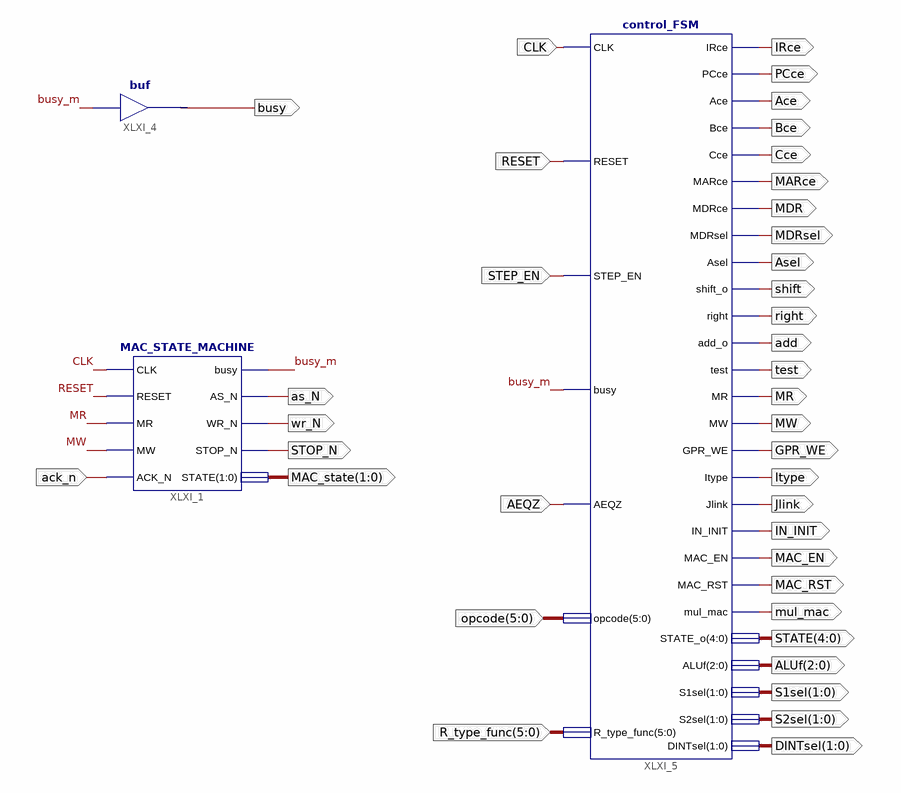
[diagram p0: schematic sheet 1]
// Xilinx ISE schematic control.sch (spartan6) as structural Verilog: 3 symbols, 40 ports
module control (
  input  CLK,
  input  RESET,
  input  ack_n,
  input  STEP_EN,
  input  AEQZ,
  input  [5:0] opcode,
  input  [5:0] R_type_func,
  output MR,
  output MW,
  output as_N,
  output wr_N,
  output STOP_N,
  output [1:0] MAC_state,
  output busy_m,
  output busy,
  output IRce,
  output PCce,
  output Ace,
  output Bce,
  output Cce,
  output MARce,
  output MDR,
  output MDRsel,
  output Asel,
  output shift,
  output right,
  output add,
  output test,
  output GPR_WE,
  output Itype,
  output Jlink,
  output IN_INIT,
  output [4:0] STATE,
  output [2:0] ALUf,
  output [1:0] S1sel,
  output [1:0] S2sel,
  output [1:0] DINTsel,
  output MAC_EN,
  output MAC_RST,
  output mul_mac
);

  MAC_STATE_MACHINE XLXI_1 (
    .CLK(CLK), .RESET(RESET), .MR(MR), .MW(MW), .ACK_N(ack_n), .busy(busy_m), .AS_N(as_N), .WR_N(wr_N),
    .STOP_N(STOP_N), .STATE(MAC_state));
  buf XLXI_4 (busy, busy_m);
  control_FSM XLXI_5 (
    .CLK(CLK), .RESET(RESET), .STEP_EN(STEP_EN), .busy(busy_m), .AEQZ(AEQZ), .opcode(opcode),
    .R_type_func(R_type_func), .IRce(IRce), .PCce(PCce), .Ace(Ace), .Bce(Bce), .Cce(Cce), .MARce(MARce),
    .MDRce(MDR), .MDRsel(MDRsel), .Asel(Asel), .shift_o(shift), .right(right), .add_o(add), .test(test),
    .MR(MR), .MW(MW), .GPR_WE(GPR_WE), .Itype(Itype), .Jlink(Jlink), .IN_INIT(IN_INIT), .MAC_EN(MAC_EN),
    .MAC_RST(MAC_RST), .mul_mac(mul_mac), .STATE_o(STATE), .ALUf(ALUf), .S1sel(S1sel), .S2sel(S2sel),
    .DINTsel(DINTsel));
endmodule
